# Altium schematic sheet battery_voltage-meas.SchDoc: Battery Voltage Measurement
size A4; Date: 2015-09-21; Author: Piotr Kuligowski; DocumentNumber: 1; Revision: 1-0; SheetNumber: 1; SheetTotal: 14; Model: EM1
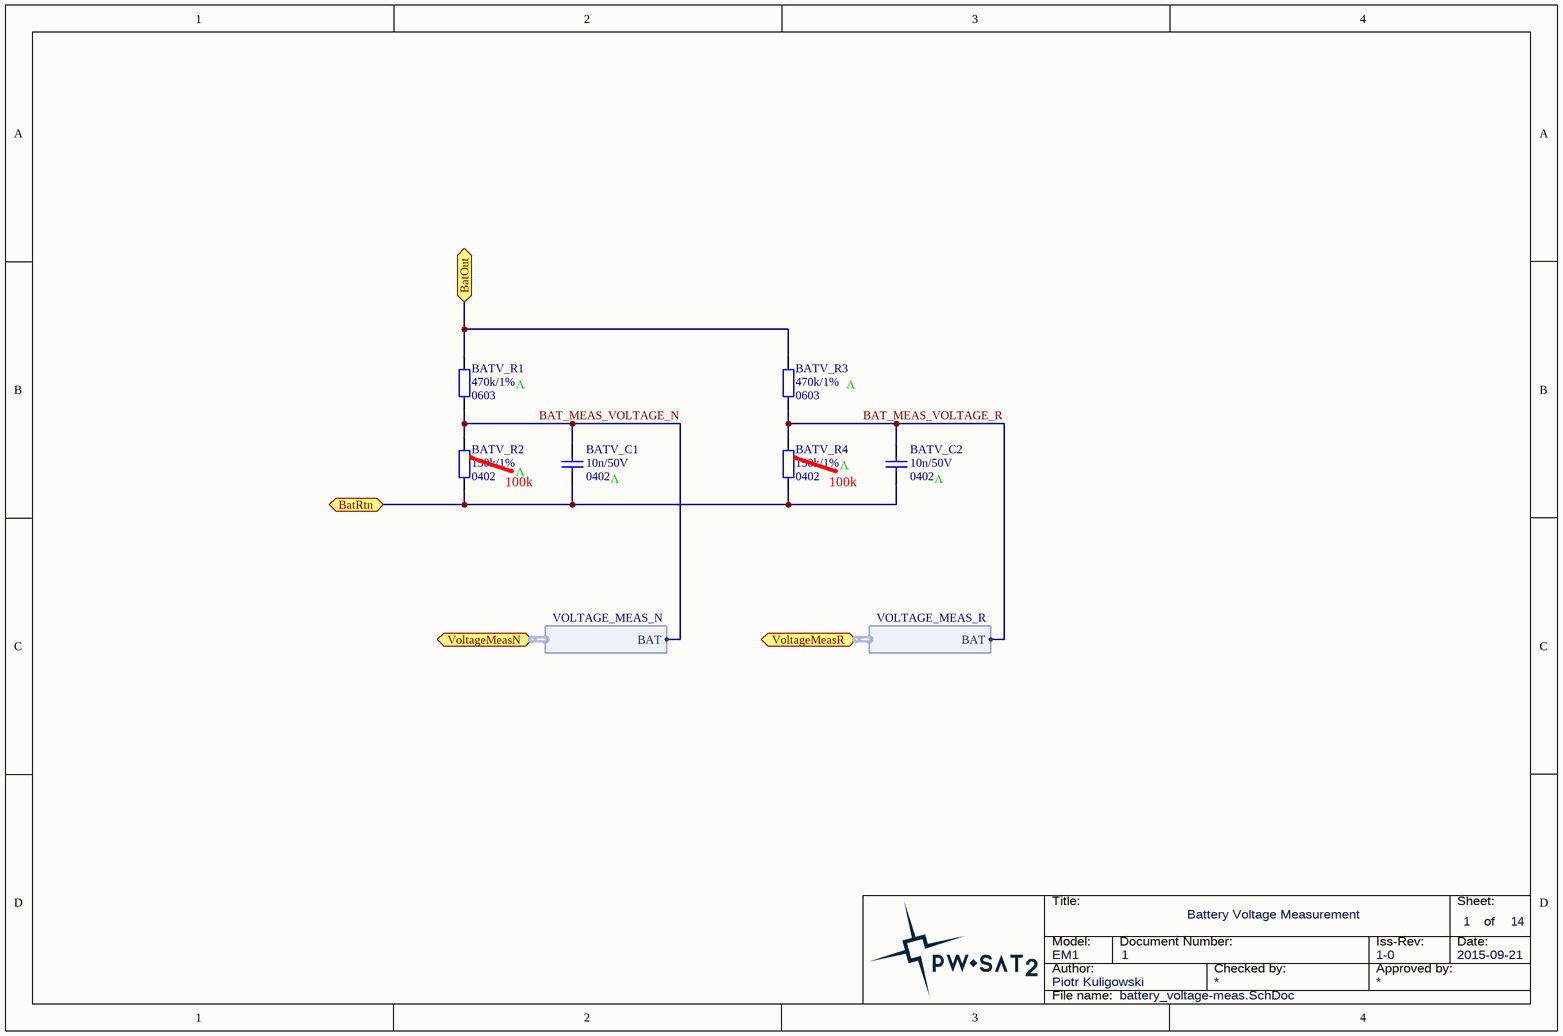
[diagram p0: battery_voltage-meas.SchDoc]

## Parts
BATV_C1  Package: 0402  [SMD_Capacitor_0402]  (hidden comment: 10n/50V)
BATV_C2  Package: 0402  [SMD_Capacitor_0402]  (hidden comment: 10n/50V)
BATV_R1  Package: 0603  [SMD_Resistor_0603]  (hidden comment: 470k/1%)
BATV_R2  Package: 0402  [SMD_Resistor_0402]  (hidden comment: 150k/1%)
BATV_R3  Package: 0603  [SMD_Resistor_0603]  (hidden comment: 470k/1%)
BATV_R4  Package: 0402  [SMD_Resistor_0402]  (hidden comment: 150k/1%)

## Ports
BatOut, BatRtn, VoltageMeasN (harness VOLTAGE_MEAS_N), VoltageMeasR (harness VOLTAGE_MEAS_R)

## Harnesses
VOLTAGE_MEAS_N: BAT
VOLTAGE_MEAS_R: BAT

## Nets
BAT_MEAS_VOLTAGE_N: BATV_C1.1 BATV_R1.2 BATV_R2.1 ; port VoltageMeasN.BAT
BAT_MEAS_VOLTAGE_R: BATV_C2.1 BATV_R3.2 BATV_R4.1 ; port VoltageMeasR.BAT
BatOut: BATV_R1.1 BATV_R3.1 ; port BatOut
BatRtn: BATV_C1.2 BATV_C2.2 BATV_R2.2 BATV_R4.2 ; port BatRtn

## Notes on the sheet
- V
- 100k
- (near BATV_C1) V
- (near BATV_C2) V
- Title:
- Sheet:
- of
- Author:
- Model:
- Document Number:
- Checked by:
- Iss-Rev:
- Approved by:
- Date:
- File name:

## Library data of the parts
BATV_C1 BATV_C2 = Cer_GCM155R71H103KA55D: Ceramic Cap Murata Automotive 10n/50V X7R 0402; Manufacturer: Murata; ManufacturerPartNumber: GCM155R71H103KA55D; Value: 10n/50V
BATV_R1 BATV_R3 = CRCW0603470KFKxxxx: 470k/1% Vishay CRCW 0603 Resistor. 100mW, 100ppm, 75V.; Manufacturer: Vishay; ManufacturerPartNumber: CRCW0603470KFKxxxx; Value: 470k/1%
BATV_R2 BATV_R4 = CRCW0402150KFKxxxx: 150k/1% Vishay CRCW 0402 Resistor. 63mW, 100ppm, 50V.; Manufacturer: Vishay; ManufacturerPartNumber: CRCW0402150KFKxxxx; Value: 150k/1%